# Altium project Reloj Digital Down.PrjPcb
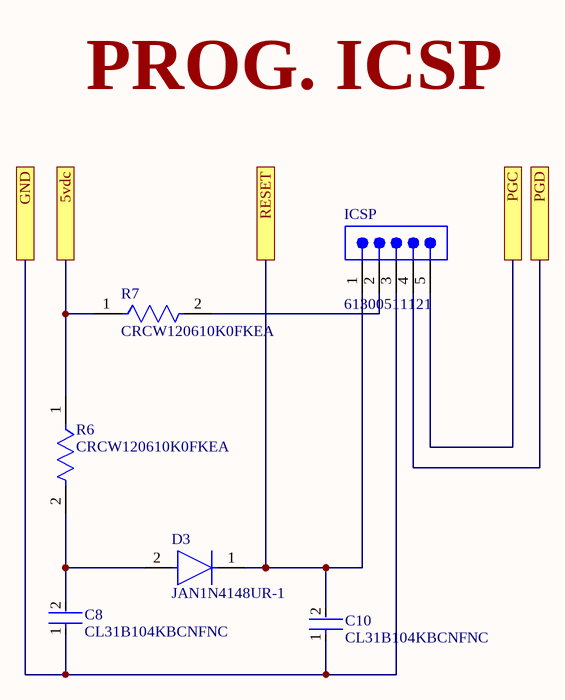
[diagram p0: Programacion ICSP.SchDoc]
3 sheets, 14 parts. Net scope: flat (ports and power ports of the same name join across sheets).
Board file: PCB Down.PcbDoc
Sheets:
  Programacion ICSP.SchDoc
  Salida PCB Front.SchDoc
  HC-06.SchDoc

## Sheet Programacion ICSP.SchDoc
size Legal; SheetNumber: 4; SheetTotal: 8

### Parts
C8  CL31B104KBCNFNC  [FP-CL31-IPC_C]
C10  CL31B104KBCNFNC  [FP-CL31-IPC_C]
D3  JAN1N4148UR-1  [FP-DO-213AA-MFG]
ICSP  61300511121  [61300511121]
R6  CRCW120610K0FKEA  [FP-CRCW1206-e3-IPC_C]
R7  CRCW120610K0FKEA  [FP-CRCW1206-e3-IPC_C]

### Ports
5vdc, GND, PGC, PGD, RESET

### Nets
5vdc: R6.1 R7.1 ; port 5vdc
GND: C8.1 C10.1 ICSP.3 ; port GND
RESET: C10.2 D3.1(C) ICSP.1 ; port RESET
NetC8_2: C8.2 D3.2(A) R6.2
NetICSP_2: ICSP.2 R7.2
NetICSP_4: ICSP.4 ; port PGD
NetICSP_5: ICSP.5 ; port PGC

### Notes on the sheet
- PROG. ICSP

### Library data of the parts
C8 C10 = CMP-13271-001276-1: Cap Ceramic 100nF 50V X7R ±10% SMD 1206 +125°C Embossed T/R; Dielectric: X7R; Case Code (Metric): 3216; Package Quantity: 1; Thickness: 0.037inch; Depth: 1.6mm; Packaging: Tape and Reel; Capacitance: 100nF; Length: 0.126inch; Tolerance: 10%; Voltage Rating: 50V; Case Code (Imperial): 1206; Radiation Hardening: No; Width: 0.063inch; Case/Package: 1206; Max Operating Temperature: 125°C; Min Operating Temperature: -55°C; Height: 0.85mm; Mount: Surface Mount
D3 = CMP-06359-000008-1: DIODE GEN PURP 100V 200MA DO213
ICSP = CMP-1502-01068-2: NexarPartId: 32855526; Operating Supply Voltage: 250V; Number of Contacts: 5; Connector Type: Male Pin; Current Rating: 3A; Contact Resistance: 20mΩ; Pitch: 2.54mm; Gender: Male; Termination: Solder; RoHS: Compliant; Lead Pitch: 2.54mm; Contact Mating Length: 5.9944mm; Number of Positions: 5; Lead Free: Lead Free; Contact Plating: Gold; Number of Pins: 5; Min Operating Temperature: -40°C; Voltage Rating: 250V; Color: Black; Mount: Through Hole; REACH SVHC: Unknown; Packaging: Bulk; Height: 8.89mm; Number of Rows: 1; Orientation: Vertical; Contact Material: Copper; Max Operating Temperature: 105°C
R6 R7 = CMP-2003-04807-2: RES Thick Film, 10kΩ, 1%, 0.25W, 100ppm/°C, 1206; Working Voltage: 200V; Max Power Dissipation: 250mW; Resistance: 10kR; Tolerance: 1%; Width: 0.063inch; Height: 0.55mm; Number of Pins: 2; Voltage Rating: 200V; Temperature Coefficient: 100ppm/°C; Military Standard: Not; Features: Automotive AEC-Q200; Depth: 1.6mm; Radiation Hardening: No; Termination: SMD/SMT; Case Code (Imperial): 1206; Weight: 0.000353oz; Length: 3.2mm; Package Quantity: 10; Voltage Rating (DC): 200V; Case/Package: 1206; Min Operating Temperature: -55°C; Number of Terminations: 2; Composition: Thick Film; Contact Plating: Tin; Power Rating: 250mW; Packaging: Tape and Reel; Max Operating Temperature: 155°C; Lead Free: Lead Free; Case Code (Metric): 3216

## Sheet Salida PCB Front.SchDoc
size Legal; SheetNumber: 5; SheetTotal: 8
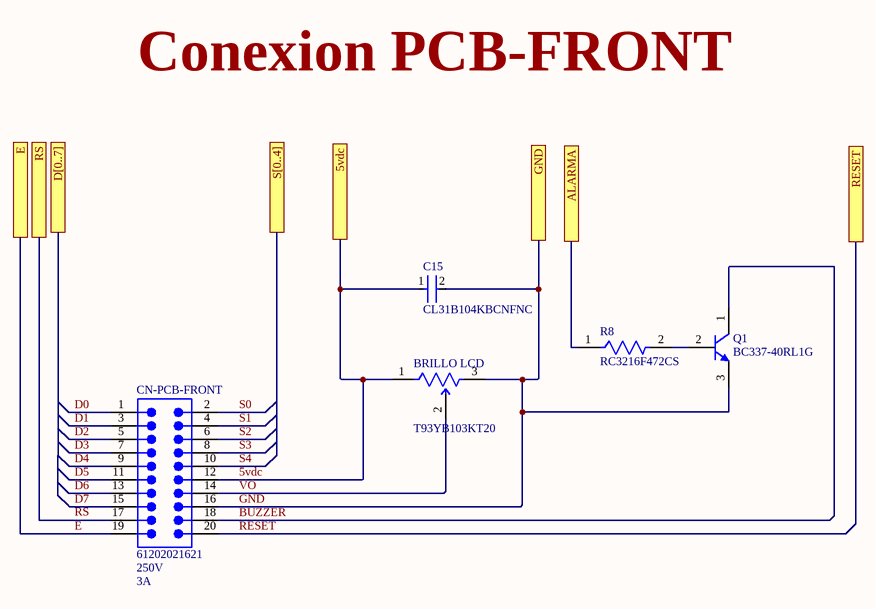
[diagram p1: Salida PCB Front.SchDoc]

### Parts
BRILLO_LCD  T93YB103KT20  [FP-T93YB-MFG]
C15  CL31B104KBCNFNC  [FP-CL31-IPC_C]
CN-PCB-FRONT  61202021621  Voltage Rating (DC): 250V  Current Rating: 3A  [61202021621]
Q1  BC337-40RL1G  [ONSC-TO-92-3-29-11_AM_BL]
R8  RC3216F472CS  [FP-RC3216-MFG]

### Ports
5vdc, ALARMA, D[0..7], E, GND, RESET, RS, S[0..4]

### Nets
5vdc: BRILLO_LCD.1(a) C15.1 CN-PCB-FRONT.12 ; port 5vdc
BUZZER: CN-PCB-FRONT.18 Q1.1(C)
D0: CN-PCB-FRONT.1
D1: CN-PCB-FRONT.3
D2: CN-PCB-FRONT.5
D3: CN-PCB-FRONT.7
D4: CN-PCB-FRONT.9
D5: CN-PCB-FRONT.11
D6: CN-PCB-FRONT.13
D7: CN-PCB-FRONT.15
E: CN-PCB-FRONT.19 ; port E
GND: BRILLO_LCD.3(c) C15.2 CN-PCB-FRONT.16 Q1.3(E) ; port GND
RESET: CN-PCB-FRONT.20 ; port RESET
RS: CN-PCB-FRONT.17 ; port RS
S0: CN-PCB-FRONT.2
S1: CN-PCB-FRONT.4
S2: CN-PCB-FRONT.6
S3: CN-PCB-FRONT.8
S4: CN-PCB-FRONT.10
VO: BRILLO_LCD.2(b) CN-PCB-FRONT.14
NetQ1_2: Q1.2(B) R8.2
NetR8_1: R8.1 ; port ALARMA

### Notes on the sheet
- Conexion PCB-FRONT

### Library data of the parts
BRILLO_LCD = CMP-00030-39738570-1: T93YB103KT20 Resistor Trimmer, Cermet, 10 kOhm, ± 10%, 500 mW, 23 Turn, Multi Turn, Through Hole; Power Rating: 500mW; Number of Turns: 21; Voltage Rating (DC): 250V; Resistance: 10kΩ; Temperature Coefficient: 100ppm/°C; Radiation Hardening: No; NexarPartId: 39738570; Max Power Dissipation: 500mW; Military Standard: Not; Max Operating Temperature: 125°C; REACH SVHC: Unknown; Height: 9.8044mm; Voltage Rating: 250V; RoHS: Compliant; Min Operating Temperature: -55°C; Mount: PCB, Through Hole; Width: 5.0038mm; Taper: Linear; Termination: Pin; Composition: Cermet; Lead Free: Lead Free; Weight: 820.009956mg; Depth: 5mm; Schedule B: 8533400080, 8533400080; Tolerance: 10%; Length: 9.7028mm
C15 = CMP-13271-001276-1: as C8 on sheet Programacion ICSP; Dielectric: X7R; Case Code (Metric): 3216; Package Quantity: 1; Thickness: 0.037inch; Depth: 1.6mm; Packaging: Tape and Reel; Capacitance: 100nF; Length: 0.126inch; Tolerance: 10%; Voltage Rating: 50V; Case Code (Imperial): 1206; Radiation Hardening: No; Width: 0.063inch; Case/Package: 1206; Max Operating Temperature: 125°C; Min Operating Temperature: -55°C; Height: 0.85mm; Mount: Surface Mount
CN-PCB-FRONT = CMP-1502-00010-2: NexarPartId: 8917785; Number of Positions: 20; Row Spacing: 2.54mm; Gender: Male; Insulation Resistance: 1GΩ; Connector Type: Male Pin; Contact Resistance: 20mΩ; Insulation: Insulated; System: Connector; Contact Material: Copper; REACH SVHC: Unknown; Width: 33.06mm; Pitch: 2.54mm; Housing Material: PBT; Number of Contacts: 20; Contact Plating: Gold; Mount: Through Hole; Termination: Through Hole; Number of Pins: 20; Color: Black; Max Operating Temperature: 105°C; Contact Gender: Male; Voltage Rating: 250V; Lead Pitch: 2.54mm; Operating Supply Voltage: 250V; Length: 33.06mm; Orientation: Vertical; Number of Rows: 2; Flammability Rating: UL94 V-0; RoHS: Compliant; Insulation Material: PBT; Min Operating Temperature: -40°C; Height: 8.85mm
Q1 = CMP-1048-01582-1: Amplifier Transistor, NPN Silicon, 3-Pin TO-92, Pb-Free, Tape and Reel; Manufacturer: On Semiconductor; IC Continuous (A): 0.8; ComponentLink2Description: Datasheet; ComponentLink1URL: http://www.onsemi.com/; ComponentLink3URL: http://www.onsemi.com/pub_link/Collateral/MAC97-D.PDF; ComponentLink2URL: http://www.onsemi.com/pub_link/Collateral/BC337-D.PDF; DatasheetVersion: Rev. 8; PackageVersion: Rev. AM; PackageReference: TO-92-3-29-11_AM_BL; PackageDescription: 3-Pin Transistor Outline, Body 4.825 x 3.685 mm, Pitch 1.27 mm; Mounting Technology: Through Hole; Polarity: NPN; ComponentLink3Description: Package Specification; Packing: Tape and Reel; PartNumber: BC337-40RL1G; ComponentLink1Description: Manufacturer URL; RoHS: TRUE
R8 = CMP-13261-005727-1: Res Thick Film 1206 4.7kΩ 1% 0.25W ±100ppm/°C Molded SMD T/R; Max Power Dissipation: 250mW; Resistance: 4.7kR; Voltage Rating (DC): 200V; Case Code (Metric): 3216; Number of Terminations: 2; Length: 0.126inch; Case/Package: 1206; Contact Plating: Tin; Features: Moisture Resistant; Radiation Hardening: No; Tolerance: 1%; Min Operating Temperature: -55°C; Depth: 1.6mm; Lead Free: Lead Free; Composition: Thick Film; Height: 0.026inch; Width: 0.063inch; Temperature Coefficient: 100ppm/°C; Max Operating Temperature: 155°C; Packaging: Tape and Reel; Case Code (Imperial): 1206; Military Standard: Not

## Sheet HC-06.SchDoc
size Legal; SheetNumber: 8; SheetTotal: 8
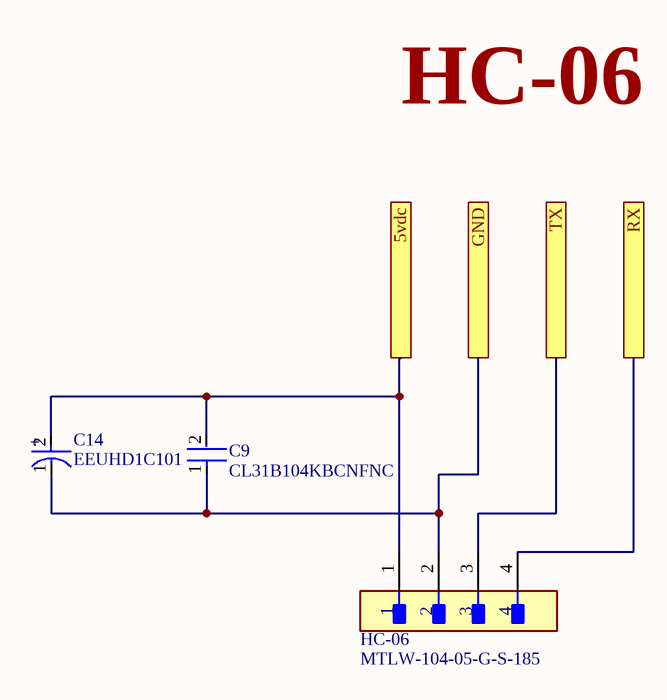
[diagram p2: HC-06.SchDoc]

### Parts
C9  CL31B104KBCNFNC  [FP-CL31-IPC_C]
C14  EEUHD1C101  [FP-RAD-TH-D_5_0_5-L_11_1-MFG]
HC-06  MTLW-104-05-G-S-185  [FP-MTLW-104-05-G-S-185-MFG]

### Ports
5vdc, GND, RX, TX

### Nets
5vdc: C9.2 C14.2(A) HC-06.1 ; port 5vdc
GND: C9.1 C14.1(C) HC-06.2 ; port GND
NetHC-06_3: HC-06.3 ; port TX
NetHC-06_4: HC-06.4 ; port RX

### Notes on the sheet
- HC-06
- (in symbol CMP-05427-000949-1) +

### Library data of the parts
C9 = CMP-13271-001276-1: as C8 on sheet Programacion ICSP; Dielectric: X7R; Case Code (Metric): 3216; Package Quantity: 1; Thickness: 0.037inch; Depth: 1.6mm; Packaging: Tape and Reel; Capacitance: 100nF; Length: 0.126inch; Tolerance: 10%; Voltage Rating: 50V; Case Code (Imperial): 1206; Radiation Hardening: No; Width: 0.063inch; Case/Package: 1206; Max Operating Temperature: 125°C; Min Operating Temperature: -55°C; Height: 0.85mm; Mount: Surface Mount
C14 = CMP-05427-000949-1: Aluminum Electrolytic Capacitors (Radial Lead Type) AEC-Q200 Qualified 100uF ±20% 16V; Lead/Base Style: Straight; Life (Hours): 1000Hour; Polarity: Polar; Ripple Current: 110mA; Lead Diameter: 0.5mm; Packaging: Bulk; Tolerance: 20%; Package Quantity: 200; Lead Pitch: 2.5mm; RoHS Compliant: Yes; Length: 11mm; Capacitance: 100uF; Max Operating Temperature: 105°C; REACH SVHC: No SVHC; Termination: Radial; Lead Free: Lead Free; Number of Pins: 2; Ripple Current (AC): 110mA; Mount: Through Hole; Diameter: 5mm; Min Operating Temperature: -55°C; Construction: RADIAL; Voltage Rating: 16V; Voltage Rating (DC): 16V; Case/Package: Radial; Height: 11mm; Height - Seated (Max): 0.492inch; Voltage: 16V; Series: HD
HC-06 = CMP-02766-000562-1: CONN HEADER VERT 4POS 2.54MM; Number of Contacts: 4; Contact Resistance: 15mR; Connector Type: Male Pin; Gender: Male; Contact Material: Brass; Height: 6.4mm; Contact Mating Length: 0.185inch; Length: 29.64mm; Number of Positions: 4; Packaging: Rail/Tube; Mount: Through Hole; Depth: 2.48mm; Number of Rows: 1; Radiation Hardening: No; Housing Material: Polymer; Pitch: 2.54mm; Max Operating Temperature: 105°C; Termination: Solder; Min Operating Temperature: -40°C; Color: Black; Orientation: Straight; Housing Color: Black; Contact Plating: Gold

## Nets that join several sheets
5vdc: Programacion ICSP (R6.1 R7.1), Salida PCB Front (BRILLO_LCD.1 C15.1 CN-PCB-FRONT.12), HC-06 (C9.2 C14.2 HC-06.1)
GND: Programacion ICSP (C8.1 C10.1 ICSP.3), Salida PCB Front (BRILLO_LCD.3 C15.2 CN-PCB-FRONT.16 Q1.3), HC-06 (C9.1 C14.1 HC-06.2)
RESET: Programacion ICSP (C10.2 D3.1 ICSP.1), Salida PCB Front (CN-PCB-FRONT.20)